# Altium schematic sheet Scan card SSR.SchDoc: Solid State Relays
size A3; DrawnBy: G Ivanov; Revision: 00; SheetNumber: 2; SheetTotal: 2; ProjectTitle: SCAN2000-20 STM32 Card; Variant: [No variants]; SheetSize: A3
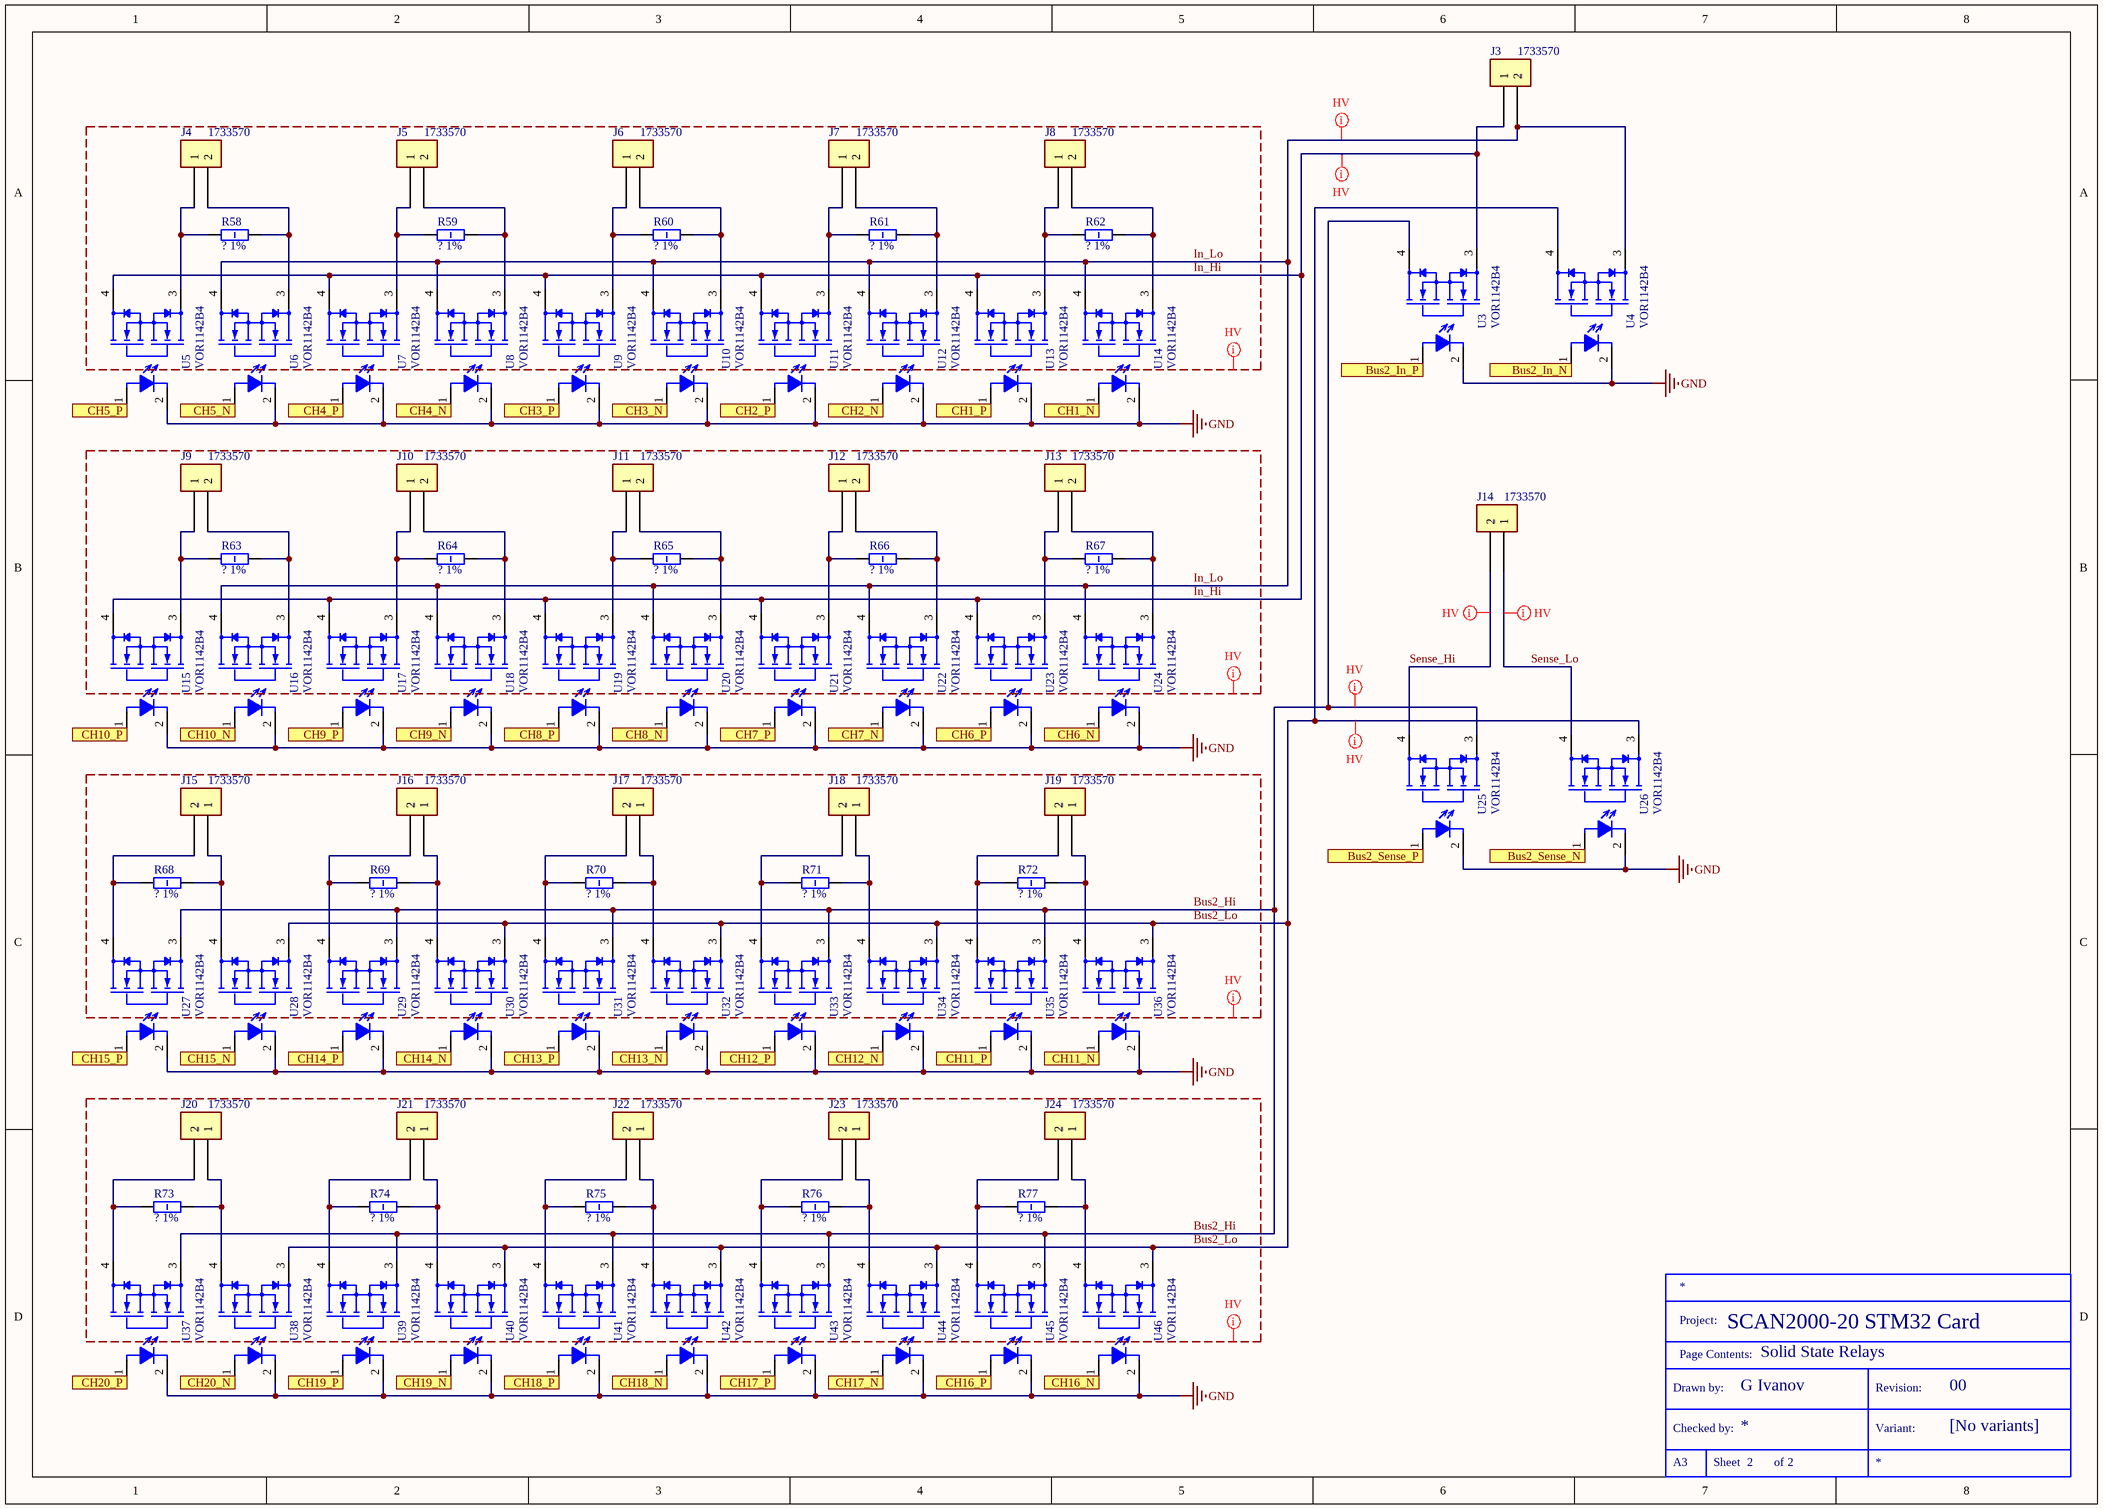
[diagram p0: Scan card SSR.SchDoc]

## Parts
J3  1733570  [Phoenix Contact 1733570]
J4  1733570  [Phoenix Contact 1733570]
J5  1733570  [Phoenix Contact 1733570]
J6  1733570  [Phoenix Contact 1733570]
J7  1733570  [Phoenix Contact 1733570]
J8  1733570  [Phoenix Contact 1733570]
J9  1733570  [Phoenix Contact 1733570]
J10  1733570  [Phoenix Contact 1733570]
J11  1733570  [Phoenix Contact 1733570]
J12  1733570  [Phoenix Contact 1733570]
J13  1733570  [Phoenix Contact 1733570]
J14  1733570  [Phoenix Contact 1733570]
J15  1733570  [Phoenix Contact 1733570]
J16  1733570  [Phoenix Contact 1733570]
J17  1733570  [Phoenix Contact 1733570]
J18  1733570  [Phoenix Contact 1733570]
J19  1733570  [Phoenix Contact 1733570]
J20  1733570  [Phoenix Contact 1733570]
J21  1733570  [Phoenix Contact 1733570]
J22  1733570  [Phoenix Contact 1733570]
J23  1733570  [Phoenix Contact 1733570]
J24  1733570  [Phoenix Contact 1733570]
R58  ? 1%  [RESC6431X06N]
R59  ? 1%  [RESC6431X06N]
R60  ? 1%  [RESC6431X06N]
R61  ? 1%  [RESC6431X06N]
R62  ? 1%  [RESC6431X06N]
R63  ? 1%  [RESC6431X06N]
R64  ? 1%  [RESC6431X06N]
R65  ? 1%  [RESC6431X06N]
R66  ? 1%  [RESC6431X06N]
R67  ? 1%  [RESC6431X06N]
R68  ? 1%  [RESC6431X06N]
R69  ? 1%  [RESC6431X06N]
R70  ? 1%  [RESC6431X06N]
R71  ? 1%  [RESC6431X06N]
R72  ? 1%  [RESC6431X06N]
R73  ? 1%  [RESC6431X06N]
R74  ? 1%  [RESC6431X06N]
R75  ? 1%  [RESC6431X06N]
R76  ? 1%  [RESC6431X06N]
R77  ? 1%  [RESC6431X06N]
TBLOCK?  *  (value not drawn)  (graphical)
U3  VOR1142B4  [SOP254P1000X380-4N]
U4  VOR1142B4  [SOP254P1000X380-4N]
U5  VOR1142B4  [SOP254P1000X380-4N]
U6  VOR1142B4  [SOP254P1000X380-4N]
U7  VOR1142B4  [SOP254P1000X380-4N]
U8  VOR1142B4  [SOP254P1000X380-4N]
U9  VOR1142B4  [SOP254P1000X380-4N]
U10  VOR1142B4  [SOP254P1000X380-4N]
U11  VOR1142B4  [SOP254P1000X380-4N]
U12  VOR1142B4  [SOP254P1000X380-4N]
U13  VOR1142B4  [SOP254P1000X380-4N]
U14  VOR1142B4  [SOP254P1000X380-4N]
U15  VOR1142B4  [SOP254P1000X380-4N]
U16  VOR1142B4  [SOP254P1000X380-4N]
U17  VOR1142B4  [SOP254P1000X380-4N]
U18  VOR1142B4  [SOP254P1000X380-4N]
U19  VOR1142B4  [SOP254P1000X380-4N]
U20  VOR1142B4  [SOP254P1000X380-4N]
U21  VOR1142B4  [SOP254P1000X380-4N]
U22  VOR1142B4  [SOP254P1000X380-4N]
U23  VOR1142B4  [SOP254P1000X380-4N]
U24  VOR1142B4  [SOP254P1000X380-4N]
U25  VOR1142B4  [SOP254P1000X380-4N]
U26  VOR1142B4  [SOP254P1000X380-4N]
U27  VOR1142B4  [SOP254P1000X380-4N]
U28  VOR1142B4  [SOP254P1000X380-4N]
U29  VOR1142B4  [SOP254P1000X380-4N]
U30  VOR1142B4  [SOP254P1000X380-4N]
U31  VOR1142B4  [SOP254P1000X380-4N]
U32  VOR1142B4  [SOP254P1000X380-4N]
U33  VOR1142B4  [SOP254P1000X380-4N]
U34  VOR1142B4  [SOP254P1000X380-4N]
U35  VOR1142B4  [SOP254P1000X380-4N]
U36  VOR1142B4  [SOP254P1000X380-4N]
U37  VOR1142B4  [SOP254P1000X380-4N]
U38  VOR1142B4  [SOP254P1000X380-4N]
U39  VOR1142B4  [SOP254P1000X380-4N]
U40  VOR1142B4  [SOP254P1000X380-4N]
U41  VOR1142B4  [SOP254P1000X380-4N]
U42  VOR1142B4  [SOP254P1000X380-4N]
U43  VOR1142B4  [SOP254P1000X380-4N]
U44  VOR1142B4  [SOP254P1000X380-4N]
U45  VOR1142B4  [SOP254P1000X380-4N]
U46  VOR1142B4  [SOP254P1000X380-4N]

## Ports
Bus2_In_N (in), Bus2_In_P (in), Bus2_Sense_N (in), Bus2_Sense_P (in), CH1_N (in), CH1_P (in), CH2_N (in), CH2_P (in), CH3_N (in), CH3_P (in), CH4_N (in), CH4_P (in), CH5_N (in), CH5_P (in), CH6_N (in), CH6_P (in), CH7_N (in), CH7_P (in), CH8_N (in), CH8_P (in), CH9_N (in), CH9_P (in), CH10_N (in), CH10_P (in), CH11_N (in), CH11_P (in), CH12_N (in), CH12_P (in), CH13_N (in), CH13_P (in), CH14_N (in), CH14_P (in), CH15_N (in), CH15_P (in), CH16_N (in), CH16_P (in), CH17_N (in), CH17_P (in), CH18_N (in), CH18_P (in), CH19_N (in), CH19_P (in), CH20_N (in), CH20_P (in)

## Nets
GND: U3.2(-Control) U4.2(-Control) U5.2(-Control) U6.2(-Control) U7.2(-Control) U8.2(-Control) U9.2(-Control) U10.2(-Control) U11.2(-Control) U12.2(-Control) U13.2(-Control) U14.2(-Control) U15.2(-Control) U16.2(-Control) U17.2(-Control) U18.2(-Control) U19.2(-Control) U20.2(-Control) U21.2(-Control) U22.2(-Control) U23.2(-Control) U24.2(-Control) U25.2(-Control) U26.2(-Control) U27.2(-Control) U28.2(-Control) U29.2(-Control) U30.2(-Control) U31.2(-Control) U32.2(-Control) U33.2(-Control) U34.2(-Control) U35.2(-Control) U36.2(-Control) U37.2(-Control) U38.2(-Control) U39.2(-Control) U40.2(-Control) U41.2(-Control) U42.2(-Control) U43.2(-Control) U44.2(-Control) U45.2(-Control) U46.2(-Control)
Bus2_Hi: U3.4(2_LOAD) U25.3(1_LOAD) U27.3(1_LOAD) U29.3(1_LOAD) U31.3(1_LOAD) U33.3(1_LOAD) U35.3(1_LOAD) U37.3(1_LOAD) U39.3(1_LOAD) U41.3(1_LOAD) U43.3(1_LOAD) U45.3(1_LOAD)
Bus2_In_N: U4.1(+Control) ; port Bus2_In_N
Bus2_In_P: U3.1(+Control) ; port Bus2_In_P
Bus2_Lo: U4.4(2_LOAD) U26.3(1_LOAD) U28.3(1_LOAD) U30.3(1_LOAD) U32.3(1_LOAD) U34.3(1_LOAD) U36.3(1_LOAD) U38.3(1_LOAD) U40.3(1_LOAD) U42.3(1_LOAD) U44.3(1_LOAD) U46.3(1_LOAD)
Bus2_Sense_N: U26.1(+Control) ; port Bus2_Sense_N
Bus2_Sense_P: U25.1(+Control) ; port Bus2_Sense_P
CH1_N: U14.1(+Control) ; port CH1_N
CH1_P: U13.1(+Control) ; port CH1_P
CH2_N: U12.1(+Control) ; port CH2_N
CH2_P: U11.1(+Control) ; port CH2_P
CH3_N: U10.1(+Control) ; port CH3_N
CH3_P: U9.1(+Control) ; port CH3_P
CH4_N: U8.1(+Control) ; port CH4_N
CH4_P: U7.1(+Control) ; port CH4_P
CH5_N: U6.1(+Control) ; port CH5_N
CH5_P: U5.1(+Control) ; port CH5_P
CH6_N: U24.1(+Control) ; port CH6_N
CH6_P: U23.1(+Control) ; port CH6_P
CH7_N: U22.1(+Control) ; port CH7_N
CH7_P: U21.1(+Control) ; port CH7_P
CH8_N: U20.1(+Control) ; port CH8_N
CH8_P: U19.1(+Control) ; port CH8_P
CH9_N: U18.1(+Control) ; port CH9_N
CH9_P: U17.1(+Control) ; port CH9_P
CH10_N: U16.1(+Control) ; port CH10_N
CH10_P: U15.1(+Control) ; port CH10_P
CH11_N: U36.1(+Control) ; port CH11_N
CH11_P: U35.1(+Control) ; port CH11_P
CH12_N: U34.1(+Control) ; port CH12_N
CH12_P: U33.1(+Control) ; port CH12_P
CH13_N: U32.1(+Control) ; port CH13_N
CH13_P: U31.1(+Control) ; port CH13_P
CH14_N: U30.1(+Control) ; port CH14_N
CH14_P: U29.1(+Control) ; port CH14_P
CH15_N: U28.1(+Control) ; port CH15_N
CH15_P: U27.1(+Control) ; port CH15_P
CH16_N: U46.1(+Control) ; port CH16_N
CH16_P: U45.1(+Control) ; port CH16_P
CH17_N: U44.1(+Control) ; port CH17_N
CH17_P: U43.1(+Control) ; port CH17_P
CH18_N: U42.1(+Control) ; port CH18_N
CH18_P: U41.1(+Control) ; port CH18_P
CH19_N: U40.1(+Control) ; port CH19_N
CH19_P: U39.1(+Control) ; port CH19_P
CH20_N: U38.1(+Control) ; port CH20_N
CH20_P: U37.1(+Control) ; port CH20_P
In_Hi: J3.1 U3.3(1_LOAD) U5.4(2_LOAD) U7.4(2_LOAD) U9.4(2_LOAD) U11.4(2_LOAD) U13.4(2_LOAD) U15.4(2_LOAD) U17.4(2_LOAD) U19.4(2_LOAD) U21.4(2_LOAD) U23.4(2_LOAD)
In_Lo: J3.2 U4.3(1_LOAD) U6.4(2_LOAD) U8.4(2_LOAD) U10.4(2_LOAD) U12.4(2_LOAD) U14.4(2_LOAD) U16.4(2_LOAD) U18.4(2_LOAD) U20.4(2_LOAD) U22.4(2_LOAD) U24.4(2_LOAD)
Sense_Hi: J14.2 U25.4(2_LOAD)
Sense_Lo: J14.1 U26.4(2_LOAD)
NetJ4_1: J4.1 R58.1 U5.3(1_LOAD)
NetJ4_2: J4.2 R58.2 U6.3(1_LOAD)
NetJ5_1: J5.1 R59.1 U7.3(1_LOAD)
NetJ5_2: J5.2 R59.2 U8.3(1_LOAD)
NetJ6_1: J6.1 R60.1 U9.3(1_LOAD)
NetJ6_2: J6.2 R60.2 U10.3(1_LOAD)
NetJ7_1: J7.1 R61.1 U11.3(1_LOAD)
NetJ7_2: J7.2 R61.2 U12.3(1_LOAD)
NetJ8_1: J8.1 R62.1 U13.3(1_LOAD)
NetJ8_2: J8.2 R62.2 U14.3(1_LOAD)
NetJ9_1: J9.1 R63.1 U15.3(1_LOAD)
NetJ9_2: J9.2 R63.2 U16.3(1_LOAD)
NetJ10_1: J10.1 R64.1 U17.3(1_LOAD)
NetJ10_2: J10.2 R64.2 U18.3(1_LOAD)
NetJ11_1: J11.1 R65.1 U19.3(1_LOAD)
NetJ11_2: J11.2 R65.2 U20.3(1_LOAD)
NetJ12_1: J12.1 R66.1 U21.3(1_LOAD)
NetJ12_2: J12.2 R66.2 U22.3(1_LOAD)
NetJ13_1: J13.1 R67.1 U23.3(1_LOAD)
NetJ13_2: J13.2 R67.2 U24.3(1_LOAD)
NetJ15_1: J15.1 R68.2 U28.4(2_LOAD)
NetJ15_2: J15.2 R68.1 U27.4(2_LOAD)
NetJ16_1: J16.1 R69.2 U30.4(2_LOAD)
NetJ16_2: J16.2 R69.1 U29.4(2_LOAD)
NetJ17_1: J17.1 R70.2 U32.4(2_LOAD)
NetJ17_2: J17.2 R70.1 U31.4(2_LOAD)
NetJ18_1: J18.1 R71.2 U34.4(2_LOAD)
NetJ18_2: J18.2 R71.1 U33.4(2_LOAD)
NetJ19_1: J19.1 R72.2 U36.4(2_LOAD)
NetJ19_2: J19.2 R72.1 U35.4(2_LOAD)
NetJ20_1: J20.1 R73.2 U38.4(2_LOAD)
NetJ20_2: J20.2 R73.1 U37.4(2_LOAD)
NetJ21_1: J21.1 R74.2 U40.4(2_LOAD)
NetJ21_2: J21.2 R74.1 U39.4(2_LOAD)
NetJ22_1: J22.1 R75.2 U42.4(2_LOAD)
NetJ22_2: J22.2 R75.1 U41.4(2_LOAD)
NetJ23_1: J23.1 R76.2 U44.4(2_LOAD)
NetJ23_2: J23.2 R76.1 U43.4(2_LOAD)
NetJ24_1: J24.1 R77.2 U46.4(2_LOAD)
NetJ24_2: J24.2 R77.1 U45.4(2_LOAD)

## Layout directives
mark named HV: (no net found under the mark), Bus2_Hi, Bus2_Lo, In_Hi, In_Lo, Sense_Hi, Sense_Lo

## Notes on the sheet
- (in symbol TitleBlockStandard) Project:; Page Contents:; Drawn by:; Revision:; Checked by:; Variant:; Sheet; of

## Library data of the parts
J3-J24 = 1733570: single row, 2 pins; Manufacturer: Phoenix Contact; Desctiption: PCB terminal block - SMKDSP 1,5/ 2-5,08; Part Number: 1733570; ComponentLink1Description: Technical drawing; ComponentLink1URL: Datasheets\Connectors\Phoenix Contact\1733570 technical drawing.pdf; Pin Count: 2
R58-R77 = R2512X0.6mm_Generic: Generic ? 1% 2512(6431)x0.6mm 1%; Power: 1W; Package (metric): 6431; Package (imperial): 2512; Part Number: R2512X0.6mm_Generic; Manufacturer: Generic; Height: 0.6mm; Resistance: ?; Accuracy: 1%; Pin Count: 2
TBLOCK? = TitleBlockStandard: Designator: TBLOCK?; Part Number: TitleBlockStandard
U3-U46 = VOR1142B4: Relay Ssr 2MA 1.5V Dc-in 0.14A 400V Dc-out 4-PIN DIP SMD T/r; Manufacturer: Vishay; On-State Resistance: 27R; Current: 140mA; Part Number: VOR1142B4; Voltage: 400V; Package: SOP-4